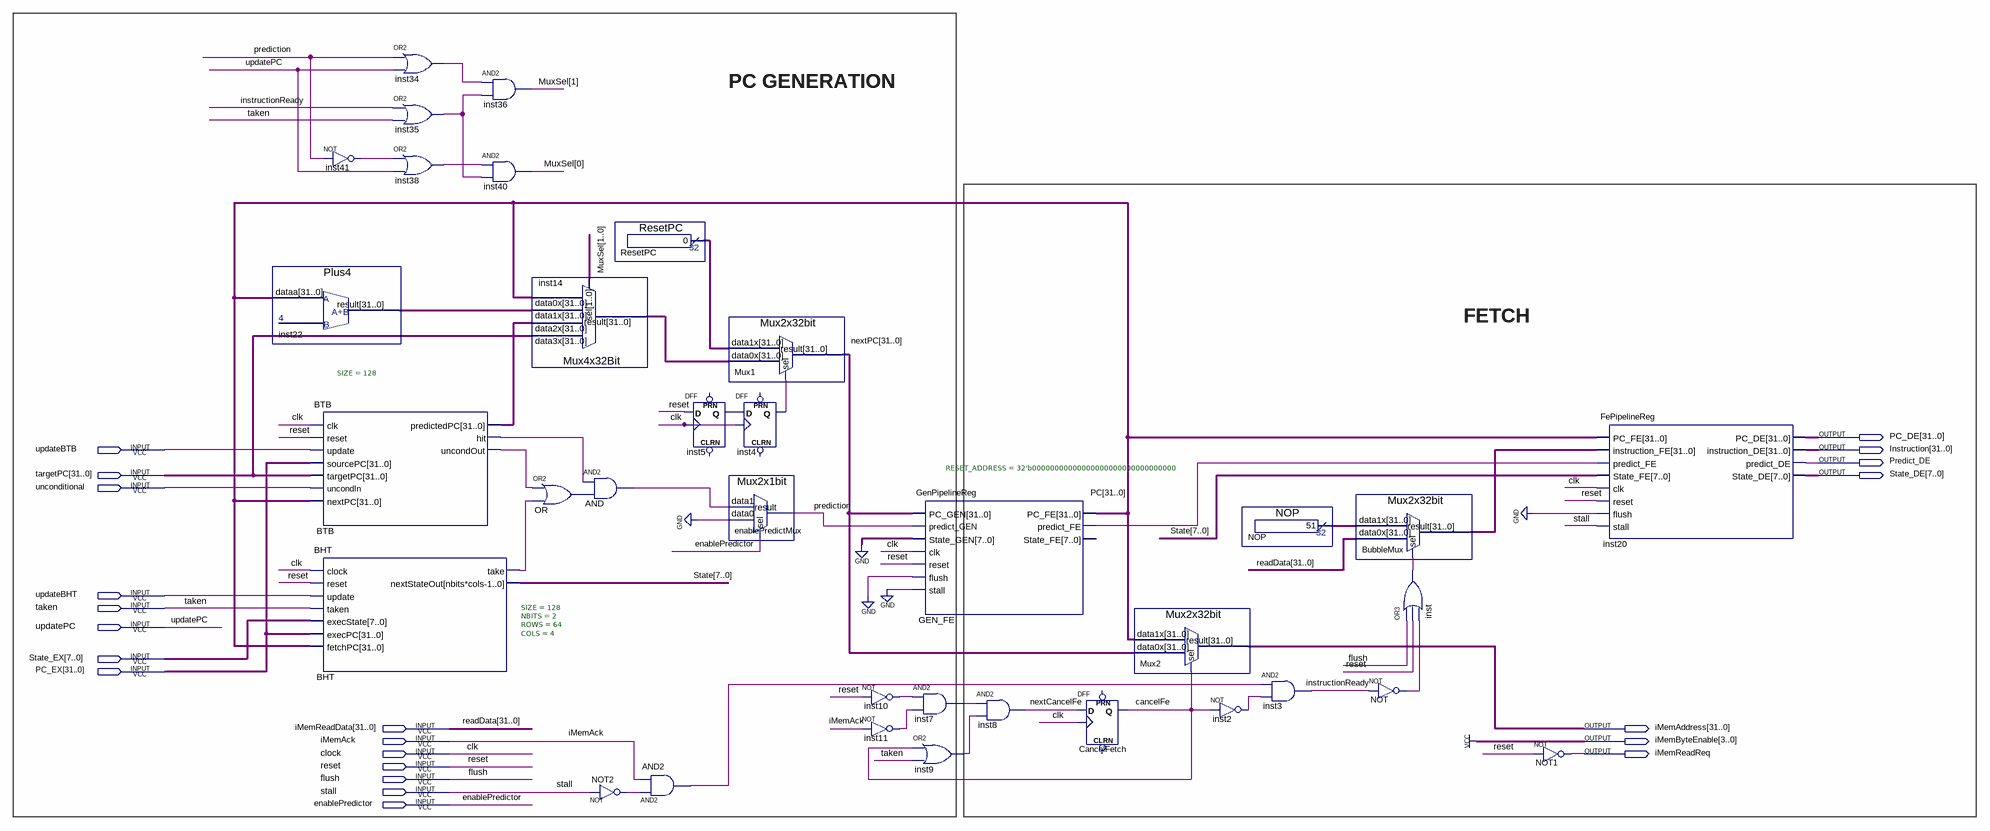
[diagram p0: schematic sheet]
// Quartus schematic Fetch.bdf as structural Verilog: 35 symbols, 22 pins
module Fetch (
  input  updateBTB,
  input  [31:0] targetPC,
  input  unconditional,
  input  updateBHT,
  input  taken,
  input  updatePC,
  input  [7:0] State_EX,
  input  [31:0] PC_EX,
  input  [31:0] iMemReadData,
  input  iMemAck,
  input  clock,
  input  reset,
  input  flush,
  input  stall,
  input  enablePredictor,
  output [31:0] PC_DE,
  output [31:0] Instruction,
  output Predict_DE,
  output [7:0] State_DE,
  output [31:0] iMemAddress,
  output [3:0] iMemByteEnable,
  output iMemReadReq
);

  wire AND2_out, AND_out, BHT_take, BTB_hit, BTB_uncondout, cancelFe, GEN_FE_predict_fe, inst2_out, inst4_q,
       inst5_q, inst7_out, inst9_out, inst10_out, inst11_out, inst34_out, inst35_out, inst38_out, inst41_out,
       inst_out, instructionReady, nextCancelFe, NOT2_out, NOT_out, OR_out, prediction;
  wire [1:0] MuxSel;
  wire [7:0] State;
  wire [31:0] BTB_predictedpc, BubbleMux_result, inst14_result, inst22_result, nextPC, NOP_result, PC,
       ResetPC_result;

  Plus4 inst22 (.dataa(PC), .result(inst22_result));
  not inst41 (inst41_out, prediction);
  BTB #(.SIZE(128)) BTB (
    .clk(clock), .reset(reset), .update(updateBTB), .sourcePC(PC_EX), .targetPC(targetPC),
    .uncondIn(unconditional), .nextPC(PC), .predictedPC(BTB_predictedpc), .hit(BTB_hit),
    .uncondOut(BTB_uncondout));
  BHT #(.SIZE(128), .NBITS(2), .ROWS(64), .COLS(4)) BHT (
    .clock(clock), .reset(reset), .update(updateBHT), .taken(taken), .execState(State_EX), .execPC(PC_EX),
    .fetchPC(PC), .take(BHT_take), .nextStateOut(State));
  or inst34 (inst34_out, prediction, updatePC);
  or inst35 (inst35_out, instructionReady, taken);
  or inst38 (inst38_out, inst41_out, updatePC);
  and inst36 (MuxSel[1], inst34_out, inst35_out);
  and inst40 (MuxSel[0], inst38_out, inst35_out);
  Mux4x32Bit inst14 (
    .data3x(targetPC), .data2x(BTB_predictedpc), .data1x(inst22_result), .data0x(PC), .sel(MuxSel),
    .result(inst14_result));
  or OR (OR_out, BTB_uncondout, BHT_take);
  and AND (AND_out, BTB_hit, OR_out);
  not NOT2 (NOT2_out, stall);
  ResetPC ResetPC (.result(ResetPC_result));
  and AND2 (AND2_out, NOT2_out, iMemAck);
  DFF inst5 (.CLK(clock), .D(reset), .Q(inst5_q));  // open: CLRN, PRN
  Mux2x32bit Mux1 (.data1x(ResetPC_result), .data0x(inst14_result), .sel(inst4_q), .result(nextPC));
  DFF inst4 (.CLK(clock), .D(inst5_q), .Q(inst4_q));  // open: CLRN, PRN
  Mux2x1bit enablePredictMux (.data1(AND_out), .data0(1'b0), .sel(enablePredictor), .result(prediction));
  not inst10 (inst10_out, reset);
  not inst11 (inst11_out, iMemAck);
  GenPipelineReg #(.RESET_ADDRESS(32'b00000000000000000000000000000000)) GEN_FE (
    .PC_GEN(nextPC), .predict_GEN(prediction), .State_GEN({8{1'b0}}), .clk(clock), .reset(reset),
    .flush(1'b0), .stall(1'b0), .PC_FE(PC), .predict_FE(GEN_FE_predict_fe));  // open: State_FE
  and inst7 (inst7_out, inst10_out, inst11_out);
  or inst9 (inst9_out, cancelFe, taken);
  and inst8 (nextCancelFe, inst7_out, inst9_out);
  DFF CancelFetch (.CLK(clock), .D(nextCancelFe), .Q(cancelFe));  // open: CLRN, PRN
  Mux2x32bit Mux2 (.data1x(PC), .data0x(nextPC), .sel(cancelFe), .result(iMemAddress));
  not inst2 (inst2_out, cancelFe);
  NOP NOP (.result(NOP_result));
  and inst3 (instructionReady, AND2_out, inst2_out);
  Mux2x32bit BubbleMux (.data1x(NOP_result), .data0x(iMemReadData), .sel(inst_out), .result(BubbleMux_result));
  or inst (inst_out, flush, reset, NOT_out);
  not NOT (NOT_out, instructionReady);
  not NOT1 (iMemReadReq, reset);
  FePipelineReg inst20 (
    .PC_FE(PC), .instruction_FE(BubbleMux_result), .predict_FE(GEN_FE_predict_fe), .State_FE(State),
    .clk(clock), .reset(reset), .flush(1'b0), .stall(stall), .PC_DE(PC_DE), .instruction_DE(Instruction),
    .predict_DE(Predict_DE), .State_DE(State_DE));

  assign iMemByteEnable = 4'b1111;

  // Other names for the same wires on the sheet: clk = clock; readData[31:0] = iMemReadData

  // Notes on the sheet:
  //   PC GENERATION
  //   FETCH
endmodule
